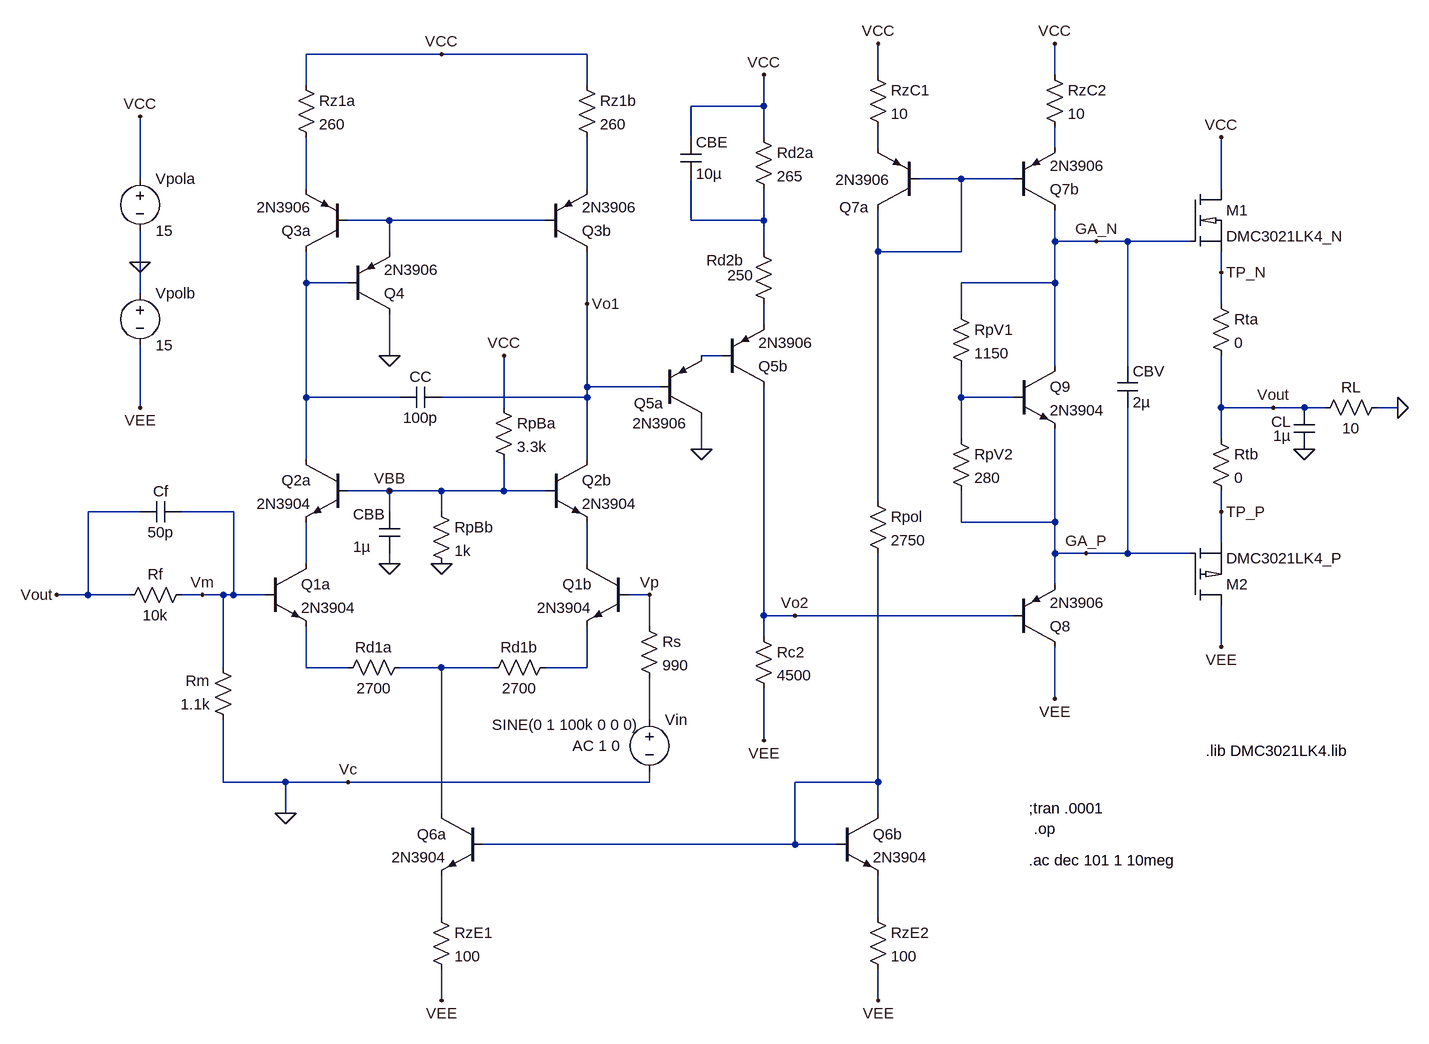
[diagram p0: schematic LT_CAFONCTIONNE_FKYEA.asc]
LT_CAFONCTIONNE_FKYEA.asc, the LTspice schematic file:
Version 4
SHEET 1 2404 1432
WIRE 288 -464 80 -464
WIRE 512 -464 288 -464
WIRE 960 -432 960 -480
WIRE 1232 -432 1232 -480
WIRE 80 -416 80 -464
WIRE 512 -416 512 -464
WIRE 784 -384 784 -432
WIRE 784 -384 672 -384
WIRE 672 -336 672 -384
WIRE 784 -336 784 -384
WIRE 960 -320 960 -352
WIRE 1232 -320 1232 -352
WIRE -176 -272 -176 -368
WIRE 1088 -272 1024 -272
WIRE 1168 -272 1088 -272
WIRE 80 -256 80 -336
WIRE 512 -256 512 -336
WIRE 1488 -256 1488 -336
WIRE 208 -208 144 -208
WIRE 448 -208 208 -208
WIRE 672 -208 672 -272
WIRE 784 -208 784 -256
WIRE 784 -208 672 -208
WIRE 1232 -176 1232 -224
WIRE 1296 -176 1232 -176
WIRE 1344 -176 1296 -176
WIRE 1440 -176 1344 -176
WIRE 208 -160 208 -208
WIRE 784 -160 784 -208
WIRE 960 -160 960 -224
WIRE 1088 -160 1088 -272
WIRE 1088 -160 960 -160
WIRE -176 -144 -176 -192
WIRE 1488 -128 1488 -160
WIRE 80 -112 80 -160
WIRE 144 -112 80 -112
WIRE 1232 -112 1232 -176
WIRE 1232 -112 1088 -112
WIRE -176 -96 -176 -144
WIRE 512 -80 512 -160
WIRE 1488 -80 1488 -128
WIRE 1088 -64 1088 -112
WIRE 784 -48 784 -80
WIRE 208 0 208 -64
WIRE 720 0 688 0
WIRE 1232 16 1232 -112
WIRE 1344 16 1344 -176
WIRE 512 48 512 -80
WIRE 624 48 512 48
WIRE 80 64 80 -112
WIRE 224 64 80 64
WIRE 512 64 512 48
WIRE 512 64 288 64
WIRE 1088 64 1088 16
WIRE 1168 64 1088 64
WIRE -176 80 -176 -16
WIRE 384 80 384 0
WIRE 1488 80 1488 0
WIRE 1568 80 1488 80
WIRE 1616 80 1568 80
WIRE 1648 80 1616 80
WIRE 1760 80 1728 80
WIRE 1088 128 1088 64
WIRE 1488 128 1488 80
WIRE 688 144 688 96
WIRE 80 160 80 64
WIRE 512 160 512 64
WIRE 208 208 144 208
WIRE 288 208 208 208
WIRE 384 208 384 160
WIRE 384 208 288 208
WIRE 448 208 384 208
WIRE 960 224 960 -160
WIRE -176 240 -256 240
WIRE -32 240 -112 240
WIRE 208 240 208 208
WIRE 288 240 288 208
WIRE 1488 240 1488 208
WIRE 1088 256 1088 208
WIRE 1232 256 1232 112
WIRE 1232 256 1088 256
WIRE 1488 288 1488 240
WIRE 1232 304 1232 256
WIRE 1280 304 1232 304
WIRE 1344 304 1344 80
WIRE 1344 304 1280 304
WIRE 1440 304 1344 304
WIRE 80 320 80 256
WIRE 208 320 208 304
WIRE 512 320 512 256
WIRE 1232 352 1232 304
WIRE -256 368 -256 240
WIRE -256 368 -304 368
WIRE -192 368 -256 368
WIRE -80 368 -112 368
WIRE -48 368 -80 368
WIRE -32 368 -32 240
WIRE -32 368 -48 368
WIRE 16 368 -32 368
WIRE 608 368 576 368
WIRE 784 400 784 48
WIRE 832 400 784 400
WIRE 1168 400 832 400
WIRE 608 416 608 368
WIRE 784 432 784 400
WIRE 1488 448 1488 384
WIRE -48 480 -48 368
WIRE 80 480 80 416
WIRE 144 480 80 480
WIRE 288 480 224 480
WIRE 368 480 288 480
WIRE 512 480 512 416
WIRE 512 480 448 480
WIRE 1232 528 1232 448
WIRE 608 560 608 496
WIRE 784 592 784 512
WIRE -48 656 -48 560
WIRE 48 656 -48 656
WIRE 144 656 48 656
WIRE 608 656 608 640
WIRE 608 656 144 656
WIRE 960 656 960 304
WIRE 960 656 832 656
WIRE 48 704 48 656
WIRE 288 704 288 480
WIRE 960 704 960 656
WIRE 832 752 832 656
WIRE 832 752 352 752
WIRE 896 752 832 752
WIRE 288 864 288 800
WIRE 960 864 960 800
WIRE 288 992 288 944
WIRE 960 992 960 944
FLAG 288 -464 VCC
FLAG -176 -368 VCC
FLAG -176 80 VEE
FLAG -176 -144 0
FLAG 288 992 VEE
FLAG 288 320 0
FLAG 208 208 VBB
FLAG 512 -80 Vo1
FLAG 1760 80 0
FLAG 1488 -336 VCC
FLAG 1488 448 VEE
FLAG 1232 -480 VCC
FLAG 1232 528 VEE
FLAG 1296 -176 GA_N
FLAG 1280 304 GA_P
FLAG 784 -432 VCC
FLAG 784 592 VEE
FLAG 832 400 Vo2
FLAG 608 368 Vp
FLAG 1568 80 Vout
FLAG -80 368 Vm
FLAG 960 992 VEE
FLAG 960 -480 VCC
FLAG 208 0 0
FLAG 688 144 0
FLAG 384 0 VCC
FLAG 208 320 0
FLAG 1488 -128 TP_N
FLAG 1488 240 TP_P
FLAG 1616 144 0
FLAG 144 656 Vc
FLAG 48 704 0
FLAG -304 368 Vout
SYMBOL npn 16 320 R0
SYMATTR InstName Q1a
SYMATTR Value 2N3904
SYMBOL npn 576 320 M0
SYMATTR InstName Q1b
SYMATTR Value 2N3904
SYMBOL npn 448 160 R0
SYMATTR InstName Q2b
SYMATTR Value 2N3904
SYMBOL npn 144 160 M0
SYMATTR InstName Q2a
SYMATTR Value 2N3904
SYMBOL pnp 144 -160 R180
SYMATTR InstName Q3a
SYMATTR Value 2N3906
SYMBOL pnp 144 -64 M180
SYMATTR InstName Q4
SYMATTR Value 2N3906
SYMBOL pnp 448 -160 M180
SYMATTR InstName Q3b
SYMATTR Value 2N3906
SYMBOL res 64 -432 R0
SYMATTR InstName Rz1a
SYMATTR Value 260
SYMBOL res 496 -432 R0
SYMATTR InstName Rz1b
SYMATTR Value 260
SYMBOL voltage 608 544 R0
WINDOW 123 -118 56 Left 2
WINDOW 39 0 0 Left 0
WINDOW 3 -242 24 Left 2
SYMATTR Value2 AC 1 0
SYMATTR Value SINE(0 1 100k 0 0 0)
SYMATTR InstName Vin
SYMBOL voltage -176 -288 R0
WINDOW 123 0 0 Left 0
WINDOW 39 0 0 Left 0
SYMATTR InstName Vpola
SYMATTR Value 15
SYMBOL voltage -176 -112 R0
WINDOW 123 0 0 Left 0
WINDOW 39 0 0 Left 0
SYMATTR InstName Vpolb
SYMATTR Value 15
SYMBOL pnp 720 48 M180
SYMATTR InstName Q5b
SYMATTR Value 2N3906
SYMBOL res 1472 -96 R0
SYMATTR InstName Rta
SYMATTR Value 0
SYMBOL res 1472 112 R0
SYMATTR InstName Rtb
SYMATTR Value 0
SYMBOL res 1744 64 R90
WINDOW 0 0 56 VBottom 2
WINDOW 3 32 56 VTop 2
SYMATTR InstName RL
SYMATTR Value 10
SYMBOL npn 1168 16 R0
SYMATTR InstName Q9
SYMATTR Value 2N3904
SYMBOL res 1072 -80 R0
SYMATTR InstName RpV1
SYMATTR Value 1150
SYMBOL res 1072 112 R0
SYMATTR InstName RpV2
SYMATTR Value 280
SYMBOL pnp 1168 448 M180
SYMATTR InstName Q8
SYMATTR Value 2N3906
SYMBOL cap 1328 16 R0
SYMATTR InstName CBV
SYMATTR Value 2µ
SYMBOL pnp 624 96 M180
WINDOW 0 -40 23 Left 2
WINDOW 3 -42 -8 Left 2
SYMATTR InstName Q5a
SYMATTR Value 2N3906
SYMBOL res 768 416 R0
SYMATTR InstName Rc2
SYMATTR Value 4500
SYMBOL cap 656 -336 R0
SYMATTR InstName CBE
SYMATTR Value 10µ
SYMBOL res -96 352 R90
WINDOW 0 0 56 VBottom 2
WINDOW 3 32 56 VTop 2
SYMATTR InstName Rf
SYMATTR Value 10k
SYMBOL res -32 576 R180
WINDOW 0 36 76 Left 2
WINDOW 3 36 40 Left 2
SYMATTR InstName Rm
SYMATTR Value 1.1k
SYMBOL res 592 400 R0
SYMATTR InstName Rs
SYMATTR Value 990
SYMBOL res 768 -352 R0
SYMATTR InstName Rd2a
SYMATTR Value 265
SYMBOL res 272 848 R0
SYMATTR InstName RzE1
SYMATTR Value 100
SYMBOL npn 352 704 M0
SYMATTR InstName Q6a
SYMATTR Value 2N3904
SYMBOL npn 896 704 R0
SYMATTR InstName Q6b
SYMATTR Value 2N3904
SYMBOL res 944 848 R0
SYMATTR InstName RzE2
SYMATTR Value 100
SYMBOL res 944 208 R0
SYMATTR InstName Rpol
SYMATTR Value 2750
SYMBOL res 1216 -448 R0
SYMATTR InstName RzC2
SYMATTR Value 10
SYMBOL res 944 -448 R0
SYMATTR InstName RzC1
SYMATTR Value 10
SYMBOL pnp 1024 -224 R180
WINDOW 0 78 4 Left 2
WINDOW 3 45 47 Left 2
SYMATTR InstName Q7a
SYMATTR Value 2N3906
SYMBOL pnp 1168 -224 M180
SYMATTR InstName Q7b
SYMATTR Value 2N3906
SYMBOL res 272 224 R0
SYMATTR InstName RpBb
SYMATTR Value 1k
SYMBOL res 368 64 R0
SYMATTR InstName RpBa
SYMATTR Value 3.3k
SYMBOL cap 192 240 R0
WINDOW 0 -40 4 Left 2
WINDOW 3 -40 54 Left 2
SYMATTR InstName CBB
SYMATTR Value 1µ
SYMBOL res 464 464 R90
WINDOW 0 0 56 VBottom 2
WINDOW 3 32 56 VTop 2
SYMATTR InstName Rd1b
SYMATTR Value 2700
SYMBOL res 240 464 R90
WINDOW 0 0 56 VBottom 2
WINDOW 3 32 56 VTop 2
SYMATTR InstName Rd1a
SYMATTR Value 2700
SYMBOL res 768 -176 R0
WINDOW 0 -72 29 Left 2
WINDOW 3 -40 52 Left 2
SYMATTR InstName Rd2b
SYMATTR Value 250
SYMBOL cap 288 48 R90
WINDOW 0 0 32 VBottom 2
WINDOW 3 32 32 VTop 2
SYMATTR InstName CC
SYMATTR Value 100p
SYMBOL cap 1600 80 R0
WINDOW 0 -35 22 Left 2
WINDOW 3 -32 43 Left 2
SYMATTR InstName CL
SYMATTR Value 1µ
SYMBOL cap -112 224 R90
WINDOW 0 0 32 VBottom 2
WINDOW 3 32 32 VTop 2
SYMATTR InstName Cf
SYMATTR Value 50p
SYMBOL nmos_3021 1440 -256 R0
SYMATTR InstName M1
SYMBOL pmos_3021 1440 384 M180
SYMATTR InstName M2
TEXT 1200 728 Left 2 !.op
TEXT 1192 776 Left 2 !.ac dec 101 1 10meg
TEXT 1192 696 Left 2 !;tran .0001
TEXT 1464 608 Left 2 !.lib DMC3021LK4.lib

The netlist it stands for:
* LT_CAFONCTIONNE_FKYEA.asc
Q1a N012 Vm N014 0 2N3904
Q1b N013 Vp N016 0 2N3904
Q2b Vo1 VBB N013 0 2N3904
Q2a N008 VBB N012 0 2N3904
Q3a N008 N006 N004 0 2N3906
Q4 0 N008 N006 0 2N3906
Q3b Vo1 N006 N005 0 2N3906
Rz1a VCC N004 260
Rz1b VCC N005 260
Vin N017 0 SINE(0 1 100k 0 0 0) AC 1 0
Vpola VCC 0 15
Vpolb 0 VEE 15
Q5b Vo2 N010 N009 0 2N3906
Rta TP_N Vout 0
Rtb Vout TP_P 0
RL 0 Vout 10
Q9 GA_N N011 GA_P 0 2N3904
RpV1 GA_N N011 1150
RpV2 N011 GA_P 280
Q8 VEE Vo2 GA_P 0 2N3906
CBV GA_N GA_P 2µ
Q5a 0 Vo1 N010 0 2N3906
Rc2 Vo2 VEE 4500
CBE VCC N007 10µ
Rf Vm Vout 10k
Rm 0 Vm 1.1k
Rs Vp N017 990
Rd2a VCC N007 265
RzE1 N019 VEE 100
Q6a N015 N018 N019 0 2N3904
Q6b N018 N018 N020 0 2N3904
RzE2 N020 VEE 100
Rpol N003 N018 2750
RzC2 VCC N002 10
RzC1 VCC N001 10
Q7a N003 N003 N001 0 2N3906
Q7b GA_N N003 N002 0 2N3906
RpBb VBB 0 1k
RpBa VCC VBB 3.3k
CBB VBB 0 1µ
Rd1b N016 N015 2700
Rd1a N015 N014 2700
Rd2b N007 N009 250
CC Vo1 N008 100p
CL Vout 0 1µ
Cf Vm Vout 50p
XM1 VCC GA_N TP_N DMC3021LK4_N  ; pins D G S
XM2 VEE GA_P TP_P DMC3021LK4_P  ; pins D G S
.model NPN NPN
.model PNP PNP
.lib standard.bjt
.op
.ac dec 101 1 10meg
;tran .0001
.lib DMC3021LK4.lib
.lib DMC3021LK4.lib
.backanno
.end